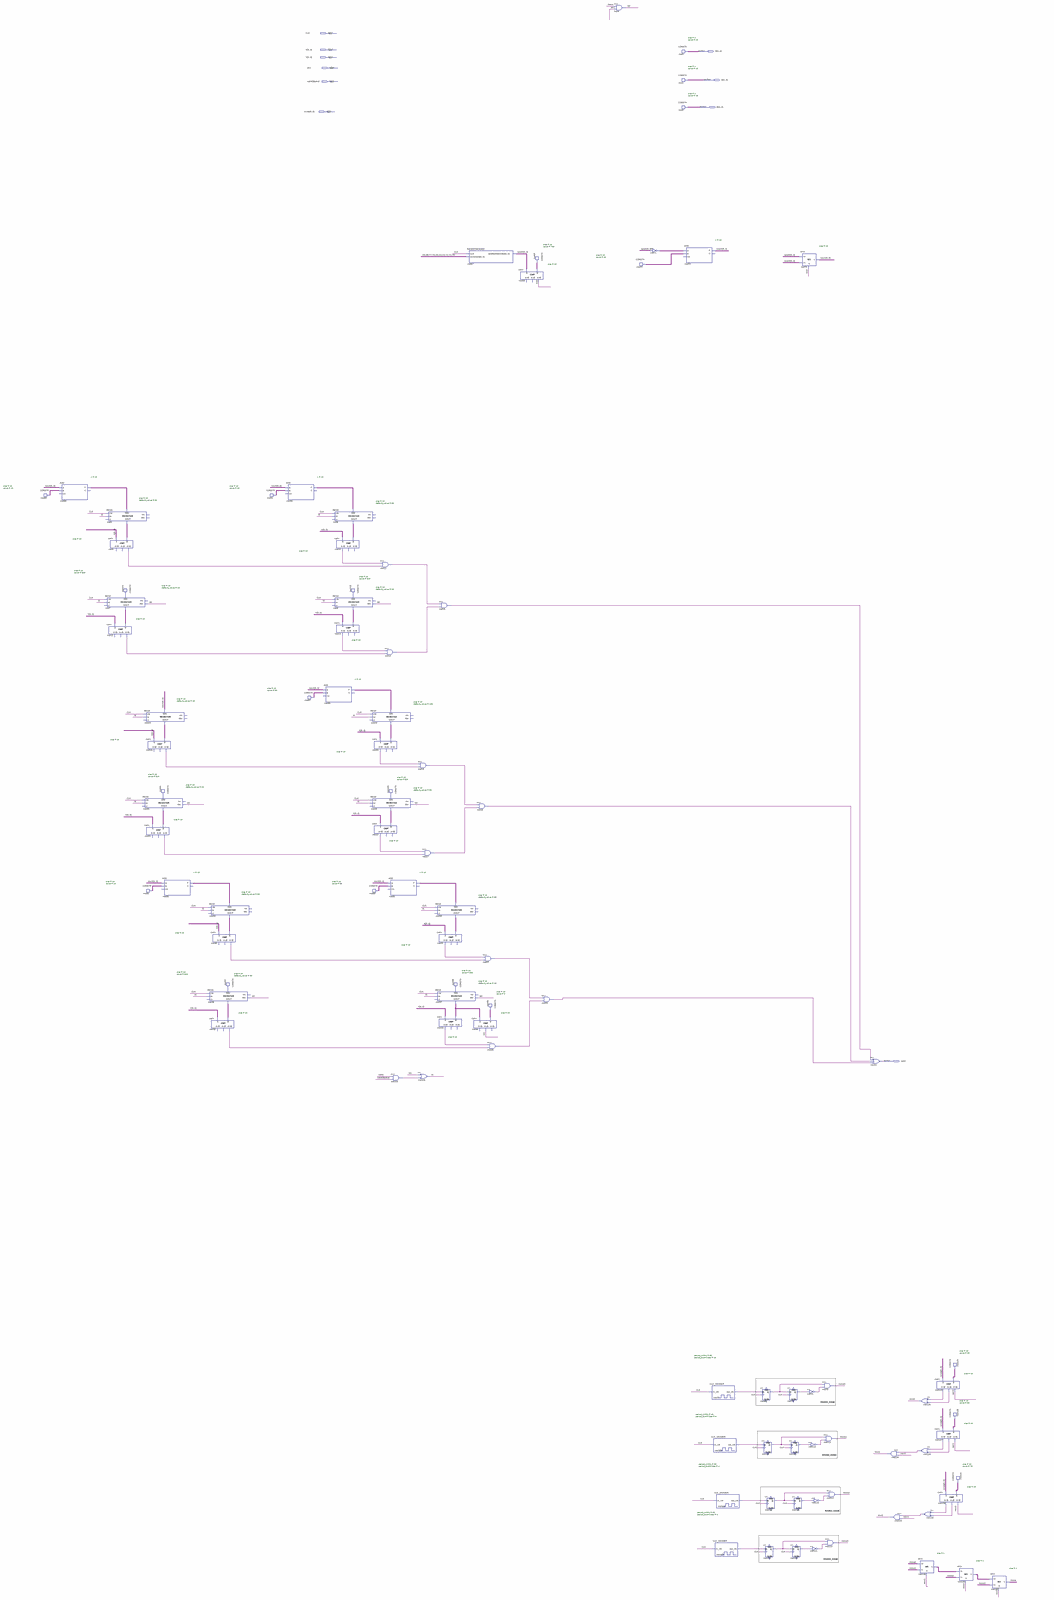
[diagram p0: schematic sheet, whole]
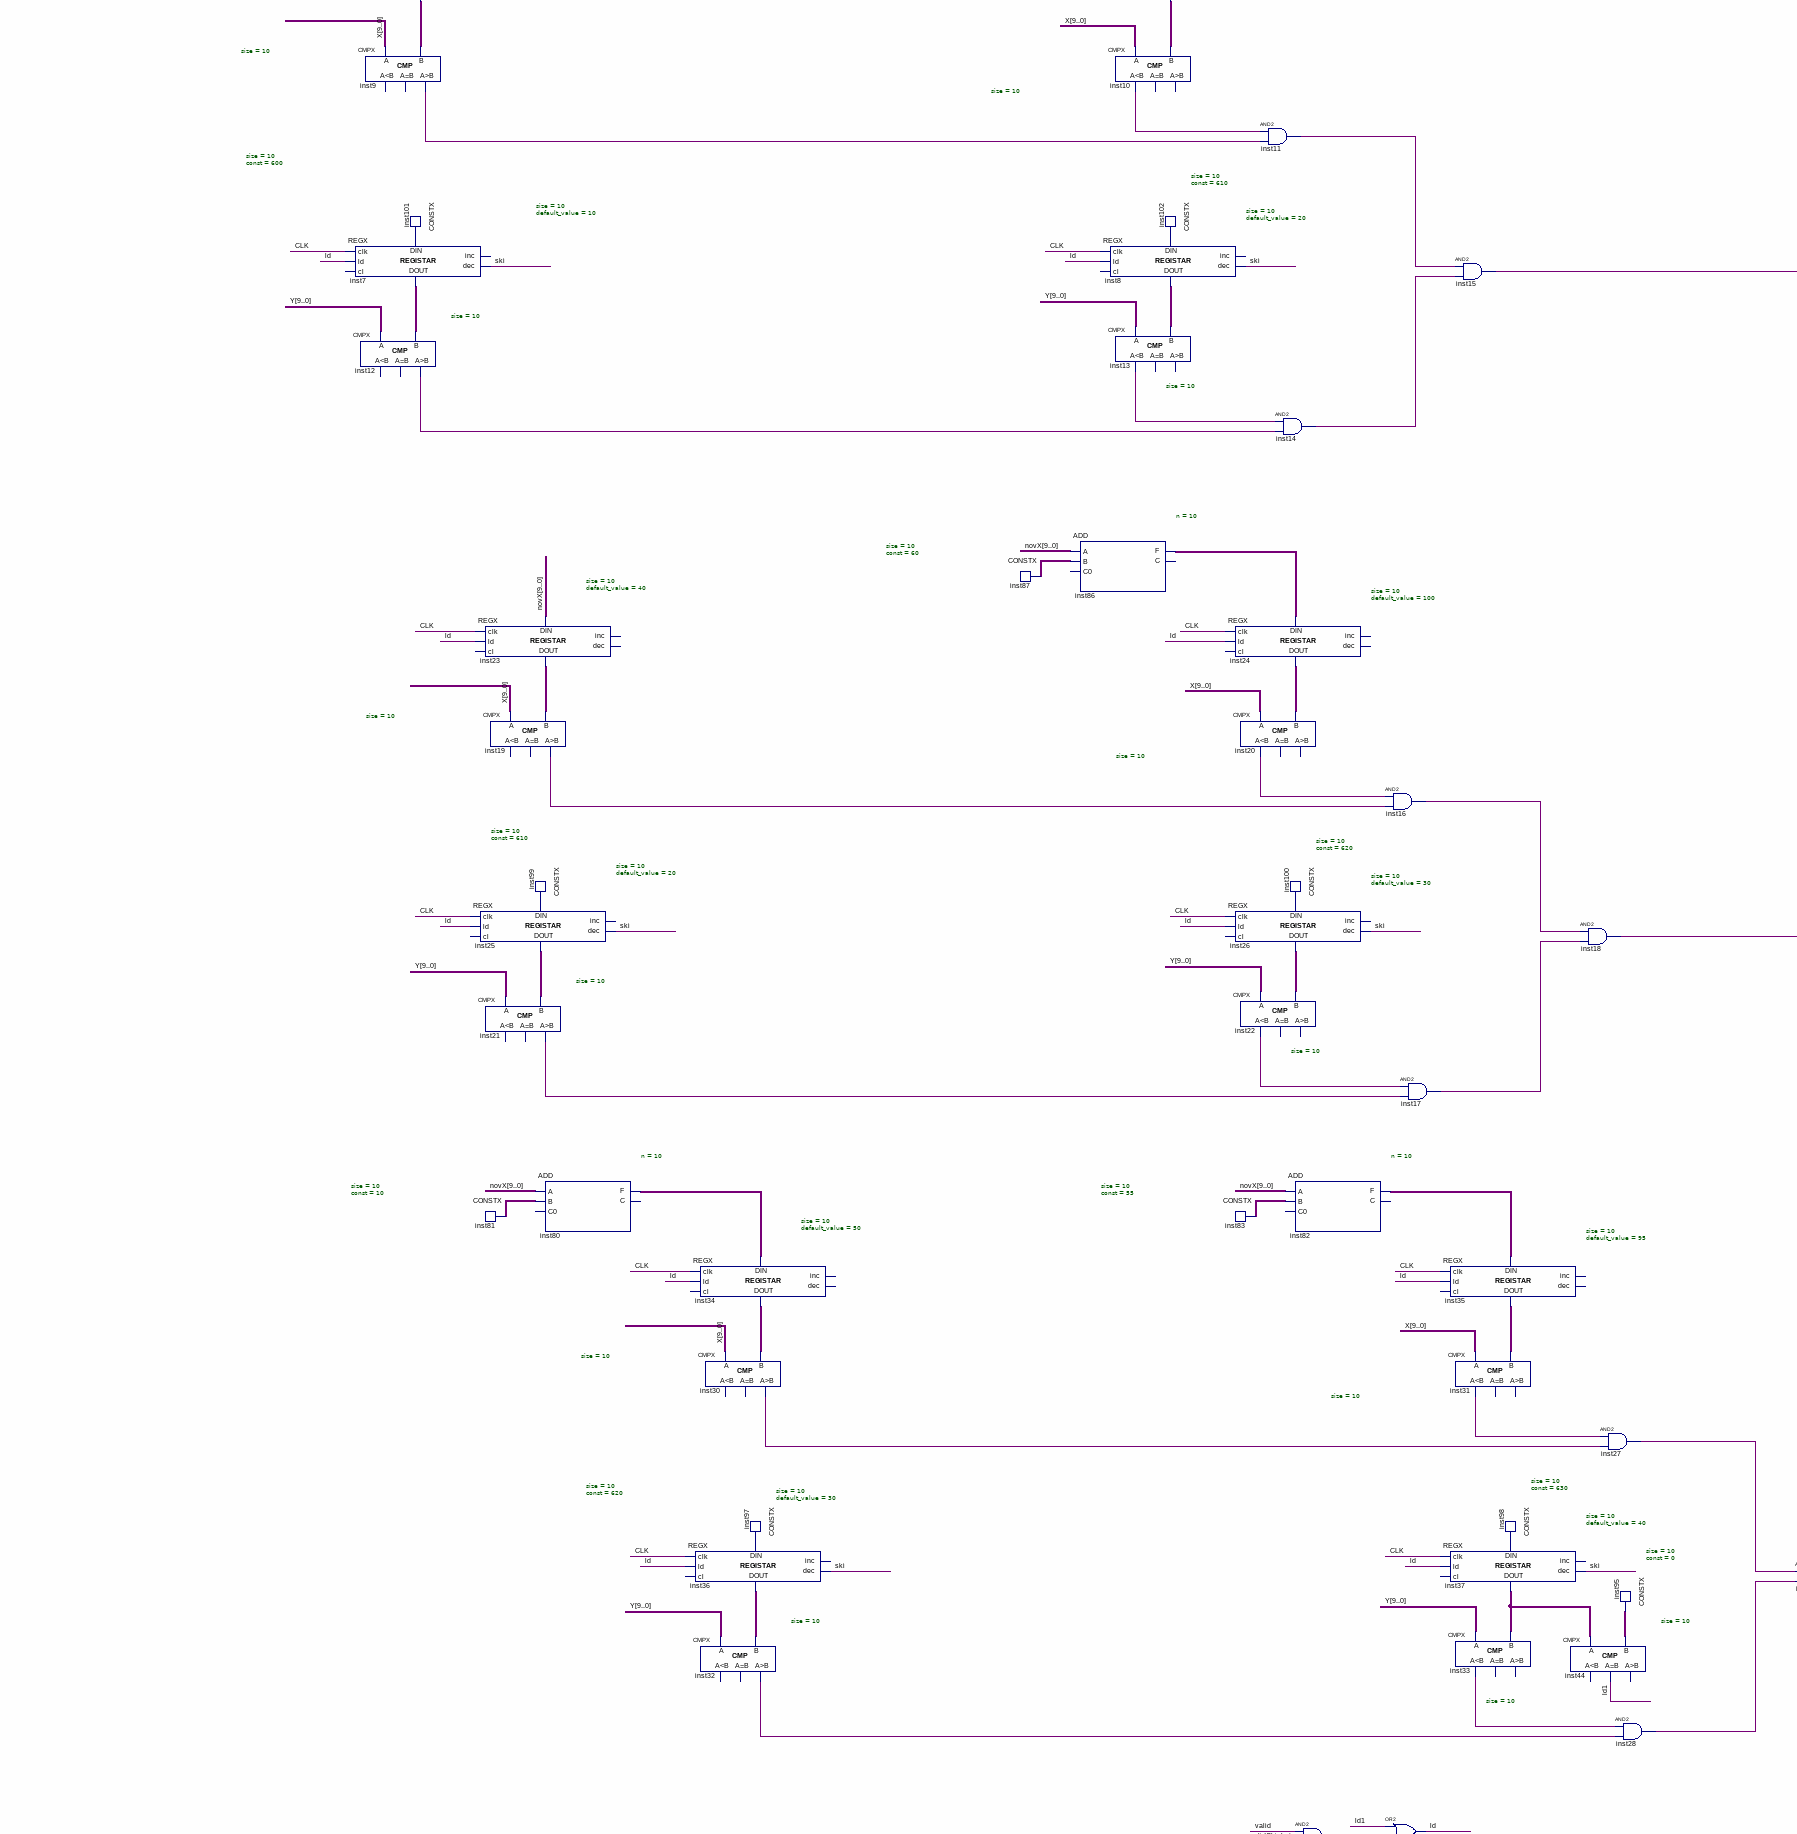
[diagram p1: schematic sheet, middle left part]
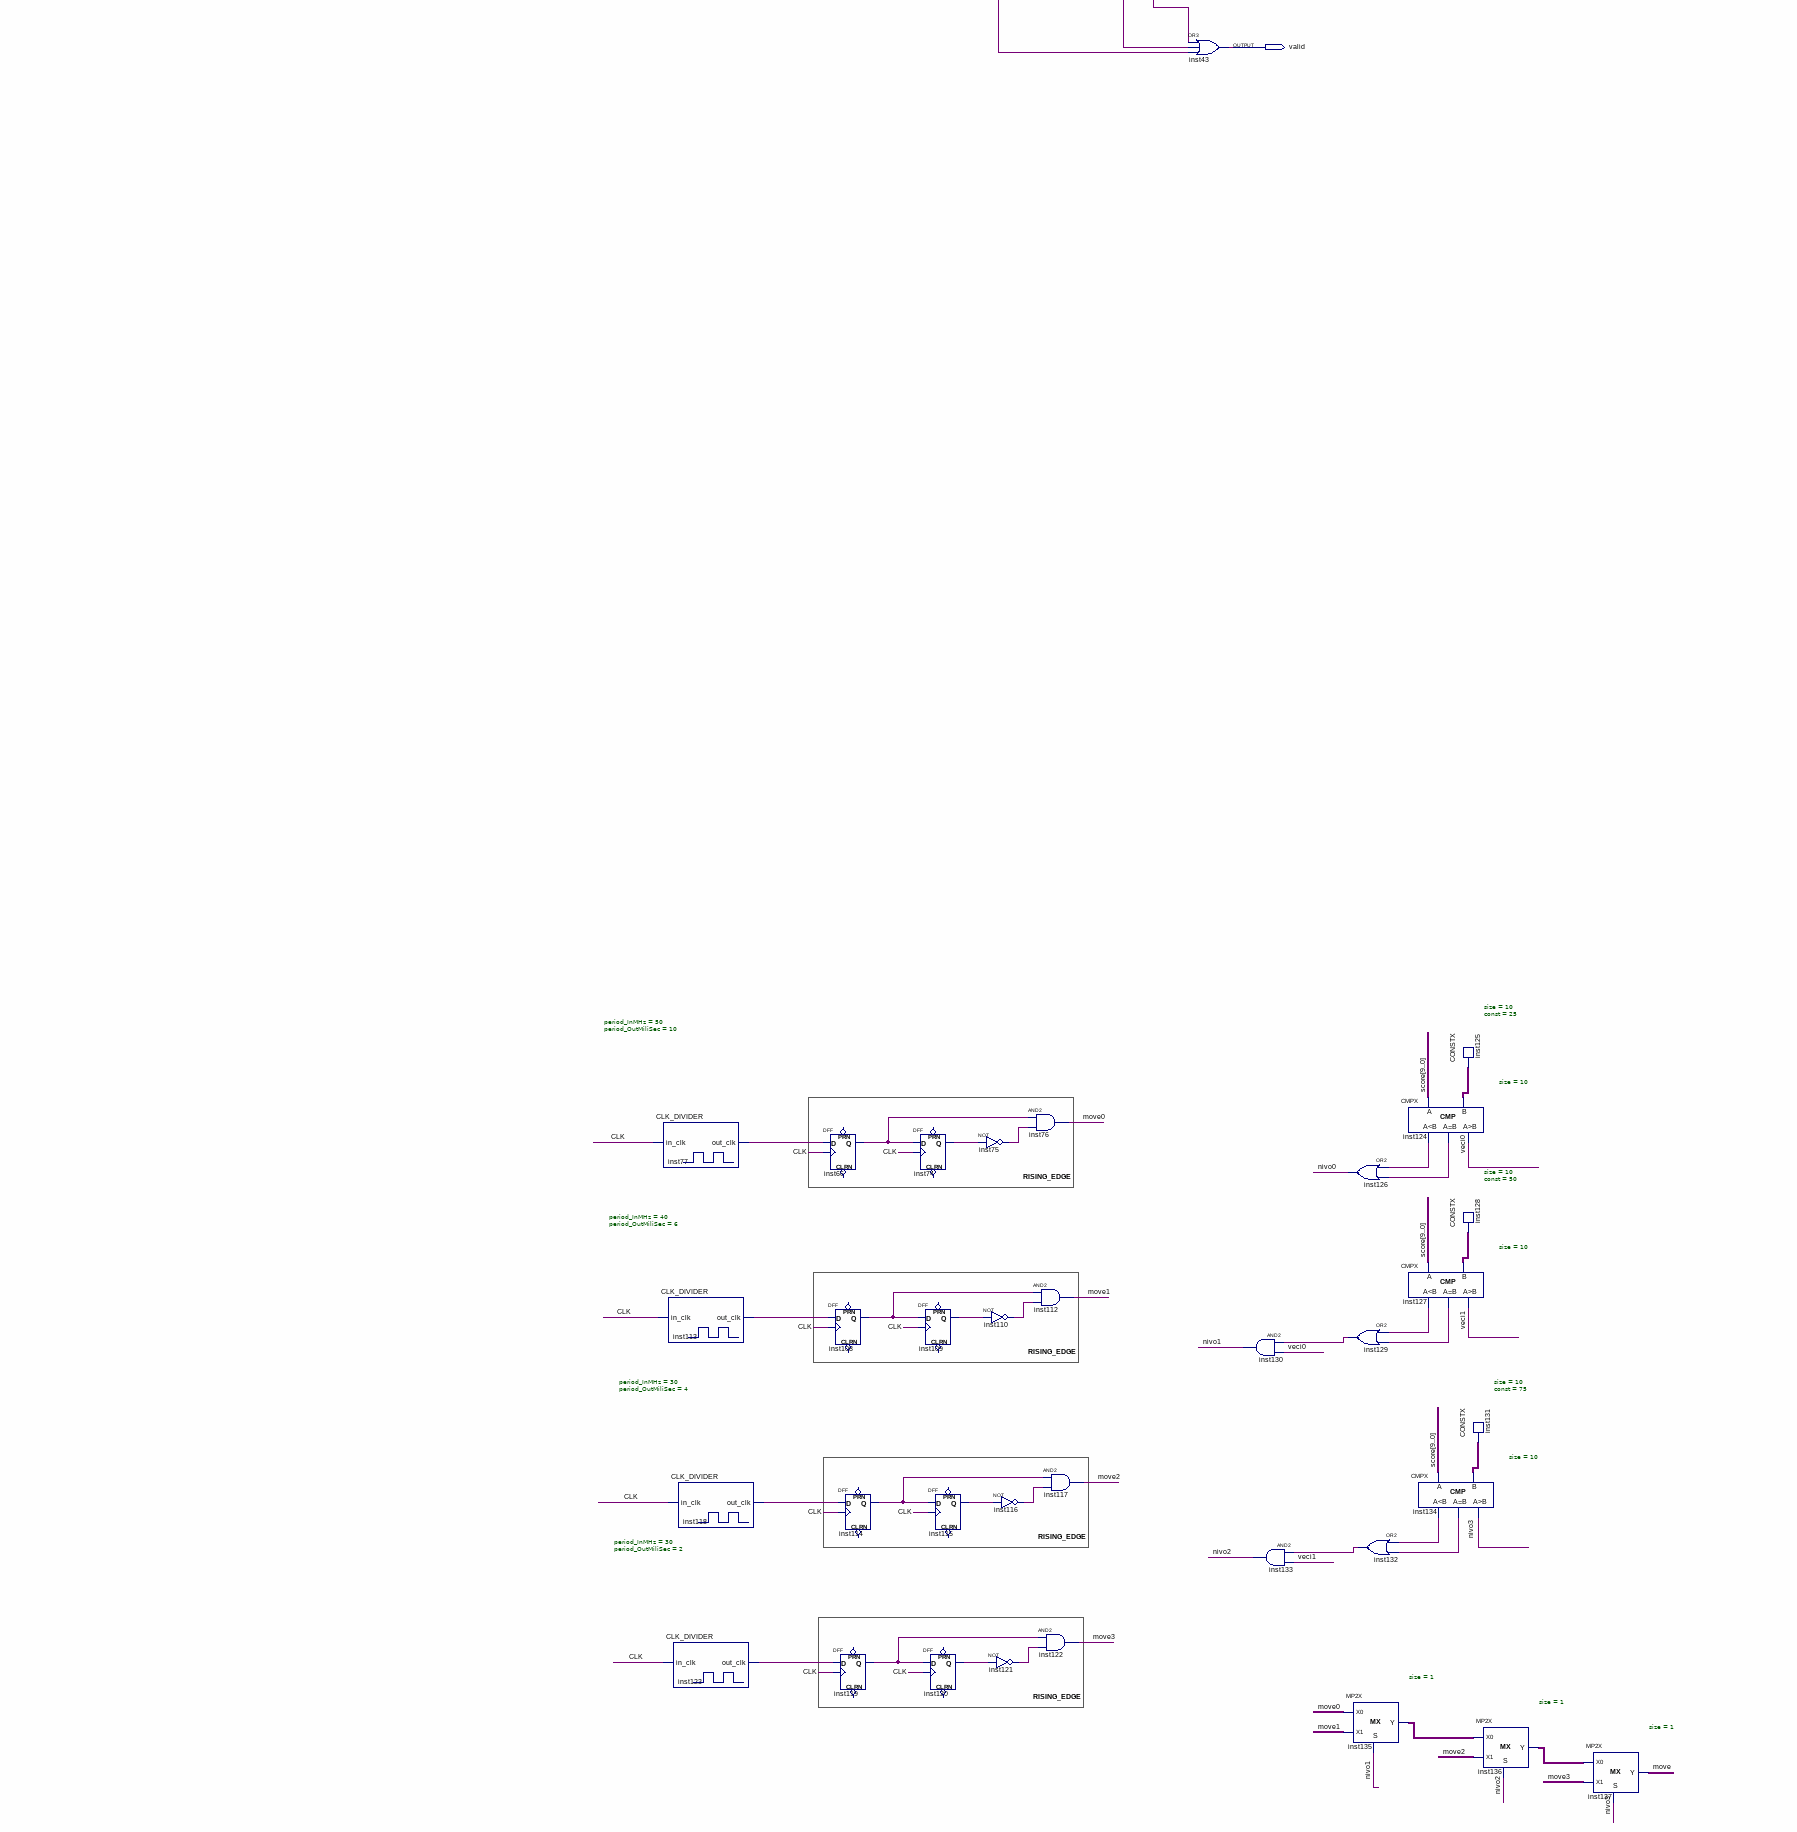
[diagram p2: schematic sheet, lower right part]
// Quartus schematic Kamen1.bdf as structural Verilog: 99 symbols, 10 pins
module Kamen1 (
  input  CLK,
  input  [9:0] X,
  input  [9:0] Y,
  input  ski1,
  input  validObjekat,
  input  [9:0] score,
  output [3:0] R,
  output [3:0] G,
  output [3:0] B,
  output valid
);

  wire inst9_gr, inst10_ls, inst11_out, inst12_gr, inst13_ls, inst14_out, inst15_out, inst16_out, inst17_out,
       inst18_out, inst19_gr, inst20_ls, inst21_gr, inst22_ls, inst27_out, inst28_out, inst29_out, inst30_gr,
       inst31_ls, inst32_gr, inst33_ls, inst66_q, inst74_q, inst75_out, inst77_out_clk, inst105_out,
       inst108_q, inst109_q, inst110_out, inst113_out_clk, inst114_q, inst115_q, inst116_out,
       inst118_out_clk, inst119_q, inst120_q, inst121_out, inst123_out_clk, inst124_eq, inst124_ls,
       inst127_eq, inst127_ls, inst129_out, inst132_out, inst134_eq, inst134_ls, inst135_y, inst136_y, ld,
       ld1, move, move0, move1, move2, move3, nivo0, nivo1, nivo2, nivo3, over, ski, veci0, veci1;
  wire [9:0] inst5_data_out, inst6_data_out, inst7_data_out, inst8_data_out, inst23_data_out,
       inst24_data_out, inst25_data_out, inst26_data_out, inst34_data_out, inst35_data_out, inst36_data_out,
       inst37_data_out, inst69_data, inst71_out, inst72_data, inst80_f, inst81_data, inst82_f, inst83_data,
       inst86_f, inst87_data, inst88_f, inst89_data, inst90_f, inst91_data, inst95_data, inst97_data,
       inst98_data, inst99_data, inst100_data, inst101_data, inst102_data, inst125_data, inst128_data,
       inst131_data, novX, overX, randX;

  CONSTX #(.size(10), .\const (10)) inst89 (.data(inst89_data));
  ADD #(.n(10)) inst88 (.A(novX), .B(inst89_data), .F(inst88_f));  // open: C0, C
  REGX #(.size(10), .default_value(10)) inst7 (
    .clk(CLK), .ld(ld), .dec(ski), .data_in(inst101_data), .data_out(inst7_data_out));  // open: cl, inc
  REGX #(.size(10), .default_value(50)) inst5 (
    .clk(CLK), .ld(ld), .data_in(inst88_f), .data_out(inst5_data_out));  // open: cl, inc, dec
  CMPX #(.size(10)) inst9 (.A(X), .B(inst5_data_out), .gr(inst9_gr));  // open: ls, eq
  CMPX #(.size(10)) inst12 (.A(Y), .B(inst7_data_out), .gr(inst12_gr));  // open: ls, eq
  CONSTX #(.size(10), .\const (600)) inst101 (.data(inst101_data));
  REGX #(.size(10), .default_value(40)) inst23 (
    .clk(CLK), .ld(ld), .data_in(novX), .data_out(inst23_data_out));  // open: cl, inc, dec
  CMPX #(.size(10)) inst19 (.A(X), .B(inst23_data_out), .gr(inst19_gr));  // open: ls, eq
  REGX #(.size(10), .default_value(20)) inst25 (
    .clk(CLK), .ld(ld), .dec(ski), .data_in(inst99_data), .data_out(inst25_data_out));  // open: cl, inc
  CMPX #(.size(10)) inst21 (.A(Y), .B(inst25_data_out), .gr(inst21_gr));  // open: ls, eq
  CONSTX #(.size(10), .\const (10)) inst81 (.data(inst81_data));
  CONSTX #(.size(10), .\const (610)) inst99 (.data(inst99_data));
  ADD #(.n(10)) inst80 (.A(novX), .B(inst81_data), .F(inst80_f));  // open: C0, C
  REGX #(.size(10), .default_value(50)) inst34 (
    .clk(CLK), .ld(ld), .data_in(inst80_f), .data_out(inst34_data_out));  // open: cl, inc, dec
  CMPX #(.size(10)) inst30 (.A(X), .B(inst34_data_out), .gr(inst30_gr));  // open: ls, eq
  REGX #(.size(10), .default_value(30)) inst36 (
    .clk(CLK), .ld(ld), .dec(ski), .data_in(inst97_data), .data_out(inst36_data_out));  // open: cl, inc
  CMPX #(.size(10)) inst32 (.A(Y), .B(inst36_data_out), .gr(inst32_gr));  // open: ls, eq
  CONSTX #(.size(10), .\const (620)) inst97 (.data(inst97_data));
  CONSTX #(.size(10), .\const (40)) inst91 (.data(inst91_data));
  ADD #(.n(10)) inst90 (.A(novX), .B(inst91_data), .F(inst90_f));  // open: C0, C
  CONSTX #(.size(10), .\const (60)) inst87 (.data(inst87_data));
  REGX #(.size(10), .default_value(80)) inst6 (
    .clk(CLK), .ld(ld), .data_in(inst90_f), .data_out(inst6_data_out));  // open: cl, inc, dec
  CMPX #(.size(10)) inst10 (.A(X), .B(inst6_data_out), .ls(inst10_ls));  // open: eq, gr
  REGX #(.size(10), .default_value(20)) inst8 (
    .clk(CLK), .ld(ld), .dec(ski), .data_in(inst102_data), .data_out(inst8_data_out));  // open: cl, inc
  CMPX #(.size(10)) inst13 (.A(Y), .B(inst8_data_out), .ls(inst13_ls));  // open: eq, gr
  ADD #(.n(10)) inst86 (.A(novX), .B(inst87_data), .F(inst86_f));  // open: C0, C
  CONSTX #(.size(10), .\const (610)) inst102 (.data(inst102_data));
  REGX #(.size(10), .default_value(100)) inst24 (
    .clk(CLK), .ld(ld), .data_in(inst86_f), .data_out(inst24_data_out));  // open: cl, inc, dec
  REGX #(.size(10), .default_value(30)) inst26 (
    .clk(CLK), .ld(ld), .dec(ski), .data_in(inst100_data), .data_out(inst26_data_out));  // open: cl, inc
  CONSTX #(.size(10), .\const (55)) inst83 (.data(inst83_data));
  and inst11 (inst11_out, inst10_ls, inst9_gr);
  CMPX #(.size(10)) inst20 (.A(X), .B(inst24_data_out), .ls(inst20_ls));  // open: eq, gr
  CMPX #(.size(10)) inst22 (.A(Y), .B(inst26_data_out), .ls(inst22_ls));  // open: eq, gr
  and inst14 (inst14_out, inst13_ls, inst12_gr);
  CONSTX #(.size(10), .\const (620)) inst100 (.data(inst100_data));
  ADD #(.n(10)) inst82 (.A(novX), .B(inst83_data), .F(inst82_f));  // open: C0, C
  and inst105 (inst105_out, valid, validObjekat);
  and inst16 (inst16_out, inst20_ls, inst19_gr);
  or inst106 (ld, ld1, inst105_out);
  and inst17 (inst17_out, inst22_ls, inst21_gr);
  and inst15 (inst15_out, inst11_out, inst14_out);
  REGX #(.size(10), .default_value(95)) inst35 (
    .clk(CLK), .ld(ld), .data_in(inst82_f), .data_out(inst35_data_out));  // open: cl, inc, dec
  CMPX #(.size(10)) inst31 (.A(X), .B(inst35_data_out), .ls(inst31_ls));  // open: eq, gr
  REGX #(.size(10), .default_value(40)) inst37 (
    .clk(CLK), .ld(ld), .dec(ski), .data_in(inst98_data), .data_out(inst37_data_out));  // open: cl, inc
  CMPX #(.size(10)) inst33 (.A(Y), .B(inst37_data_out), .ls(inst33_ls));  // open: eq, gr
  CONSTX #(.size(10), .\const (630)) inst98 (.data(inst98_data));
  RandomGenerator inst67 (.CLK(CLK), .increment({X[9:8], Y[7:6], X[5:3], Y[2:0]}), .randNumber10bit(randX));
  and inst18 (inst18_out, inst16_out, inst17_out);
  CMPX #(.size(10)) inst44 (.A(inst37_data_out), .B(inst95_data), .eq(ld1));  // open: ls, gr
  and inst27 (inst27_out, inst31_ls, inst30_gr);
  CONSTX #(.size(10), .\const (0)) inst95 (.data(inst95_data));
  and inst28 (inst28_out, inst33_ls, inst32_gr);
  CMPX #(.size(10)) inst68 (.A(randX), .B(inst69_data), .gr(over));  // open: ls, eq
  CONSTX #(.size(10), .\const (700)) inst69 (.data(inst69_data));
  and inst29 (inst29_out, inst27_out, inst28_out);
  and inst4 (ski, move, ski1);
  CONSTX #(.size(10), .\const (40)) inst72 (.data(inst72_data));
  assign inst71_out = ~randX;  // NOT inst71, 10 bits wide
  CONSTX #(.size(4), .\const (13)) inst3 (.data(R));
  CONSTX #(.size(4), .\const (13)) inst1 (.data(G));
  CONSTX #(.size(4), .\const (15)) inst2 (.data(B));
  ADD #(.n(10)) inst70 (.A(inst71_out), .B(inst72_data), .F(overX));  // open: C0, C
  CLK_DIVIDER #(.period_InMHz(50), .period_OutMiliSec(10)) inst77 (.in_clk(CLK), .out_clk(inst77_out_clk));
  CLK_DIVIDER #(.period_InMHz(40), .period_OutMiliSec(6)) inst113 (.in_clk(CLK), .out_clk(inst113_out_clk));
  CLK_DIVIDER #(.period_InMHz(30), .period_OutMiliSec(4)) inst118 (.in_clk(CLK), .out_clk(inst118_out_clk));
  CLK_DIVIDER #(.period_InMHz(30), .period_OutMiliSec(2)) inst123 (.in_clk(CLK), .out_clk(inst123_out_clk));
  DFF inst66 (.CLK(CLK), .D(inst77_out_clk), .Q(inst66_q));  // open: CLRN, PRN
  DFF inst108 (.CLK(CLK), .D(inst113_out_clk), .Q(inst108_q));  // open: CLRN, PRN
  DFF inst114 (.CLK(CLK), .D(inst118_out_clk), .Q(inst114_q));  // open: CLRN, PRN
  DFF inst119 (.CLK(CLK), .D(inst123_out_clk), .Q(inst119_q));  // open: CLRN, PRN
  DFF inst74 (.CLK(CLK), .D(inst66_q), .Q(inst74_q));  // open: CLRN, PRN
  DFF inst109 (.CLK(CLK), .D(inst108_q), .Q(inst109_q));  // open: CLRN, PRN
  DFF inst115 (.CLK(CLK), .D(inst114_q), .Q(inst115_q));  // open: CLRN, PRN
  DFF inst120 (.CLK(CLK), .D(inst119_q), .Q(inst120_q));  // open: CLRN, PRN
  MP2X #(.size(10)) inst73 (.S(over), .X0(randX), .X1(overX), .Y(novX));
  not inst75 (inst75_out, inst74_q);
  not inst110 (inst110_out, inst109_q);
  not inst116 (inst116_out, inst115_q);
  not inst121 (inst121_out, inst120_q);
  and inst76 (move0, inst66_q, inst75_out);
  and inst112 (move1, inst108_q, inst110_out);
  and inst117 (move2, inst114_q, inst116_out);
  and inst122 (move3, inst119_q, inst121_out);
  or inst43 (valid, inst15_out, inst18_out, inst29_out);
  and inst130 (nivo1, inst129_out, veci0);
  and inst133 (nivo2, inst132_out, veci1);
  or inst126 (nivo0, inst124_ls, inst124_eq);
  or inst129 (inst129_out, inst127_ls, inst127_eq);
  or inst132 (inst132_out, inst134_ls, inst134_eq);
  MP2X #(.size(1)) inst135 (.S(nivo1), .X0(move0), .X1(move1), .Y(inst135_y));
  CMPX #(.size(10)) inst124 (.A(score), .B(inst125_data), .ls(inst124_ls), .eq(inst124_eq), .gr(veci0));
  CMPX #(.size(10)) inst127 (.A(score), .B(inst128_data), .ls(inst127_ls), .eq(inst127_eq), .gr(veci1));
  CMPX #(.size(10)) inst134 (.A(score), .B(inst131_data), .ls(inst134_ls), .eq(inst134_eq), .gr(nivo3));
  CONSTX #(.size(10), .\const (25)) inst125 (.data(inst125_data));
  CONSTX #(.size(10), .\const (50)) inst128 (.data(inst128_data));
  CONSTX #(.size(10), .\const (75)) inst131 (.data(inst131_data));
  MP2X #(.size(1)) inst136 (.S(nivo2), .X0(inst135_y), .X1(move2), .Y(inst136_y));
  MP2X #(.size(1)) inst137 (.S(nivo3), .X0(inst136_y), .X1(move3), .Y(move));

  // Notes on the sheet:
  //   RISING_EDGE
  //   RISING_EDGE
  //   RISING_EDGE
  //   RISING_EDGE
endmodule
